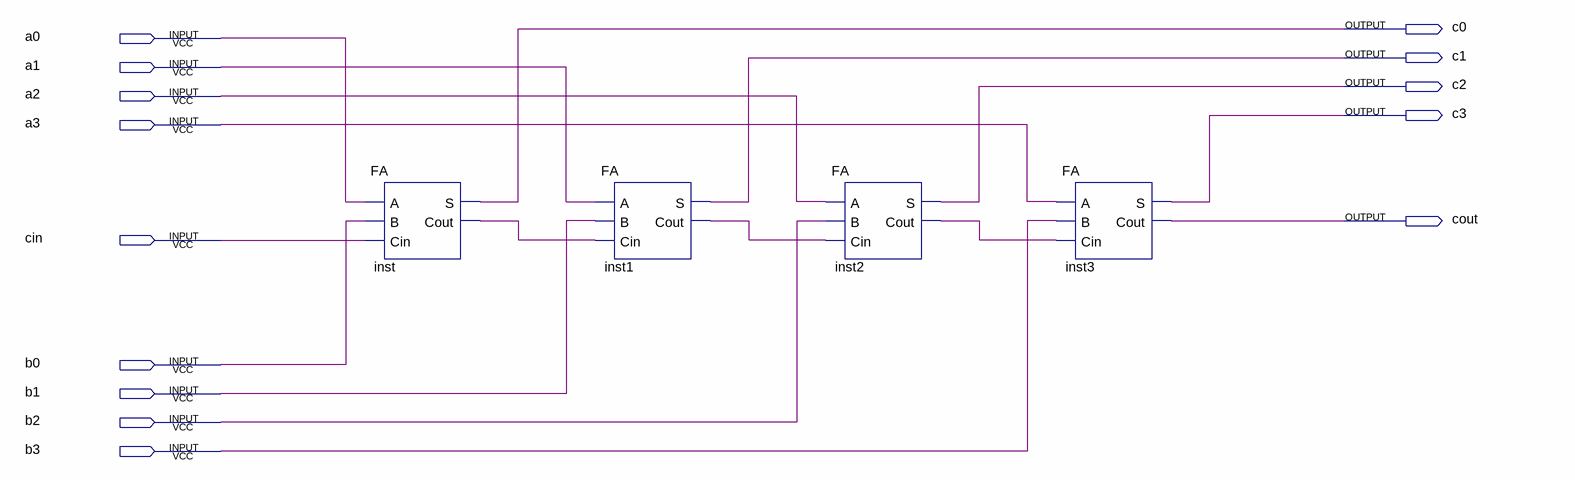
[diagram p0: schematic sheet]
// Quartus schematic Bin_Add_4bit.bdf as structural Verilog: 4 symbols, 14 pins
module Bin_Add_4bit (
  input  a0,
  input  a1,
  input  a2,
  input  a3,
  input  cin,
  input  b0,
  input  b1,
  input  b2,
  input  b3,
  output c0,
  output c1,
  output c2,
  output c3,
  output cout
);

  wire inst1_cout, inst2_cout, inst_cout;

  FA inst (.A(a0), .B(b0), .Cin(cin), .S(c0), .Cout(inst_cout));
  FA inst1 (.A(a1), .B(b1), .Cin(inst_cout), .S(c1), .Cout(inst1_cout));
  FA inst2 (.A(a2), .B(b2), .Cin(inst1_cout), .S(c2), .Cout(inst2_cout));
  FA inst3 (.A(a3), .B(b3), .Cin(inst2_cout), .S(c3), .Cout(cout));
endmodule
